# Altium schematic sheet Papilio_DUO_0.SchDoc: Papilio_DUO
size 720 x 381 mm; Date: 05/10/2018 09:53:51 p.m.; Organization: INVAP S.E.; Address1: Argentina; Address2: Rio Negro; Address3: Bariloche; Address4: Cte. Luis Piedra Buena 4950; SheetNumber: 1; DATABASE: C:/Dropbox/GadgetFactory/GadgetFactory_Engineering/Libraries/GadgetFactory-PARTSDB.txt; Rule: PcbType=ProtelPcb
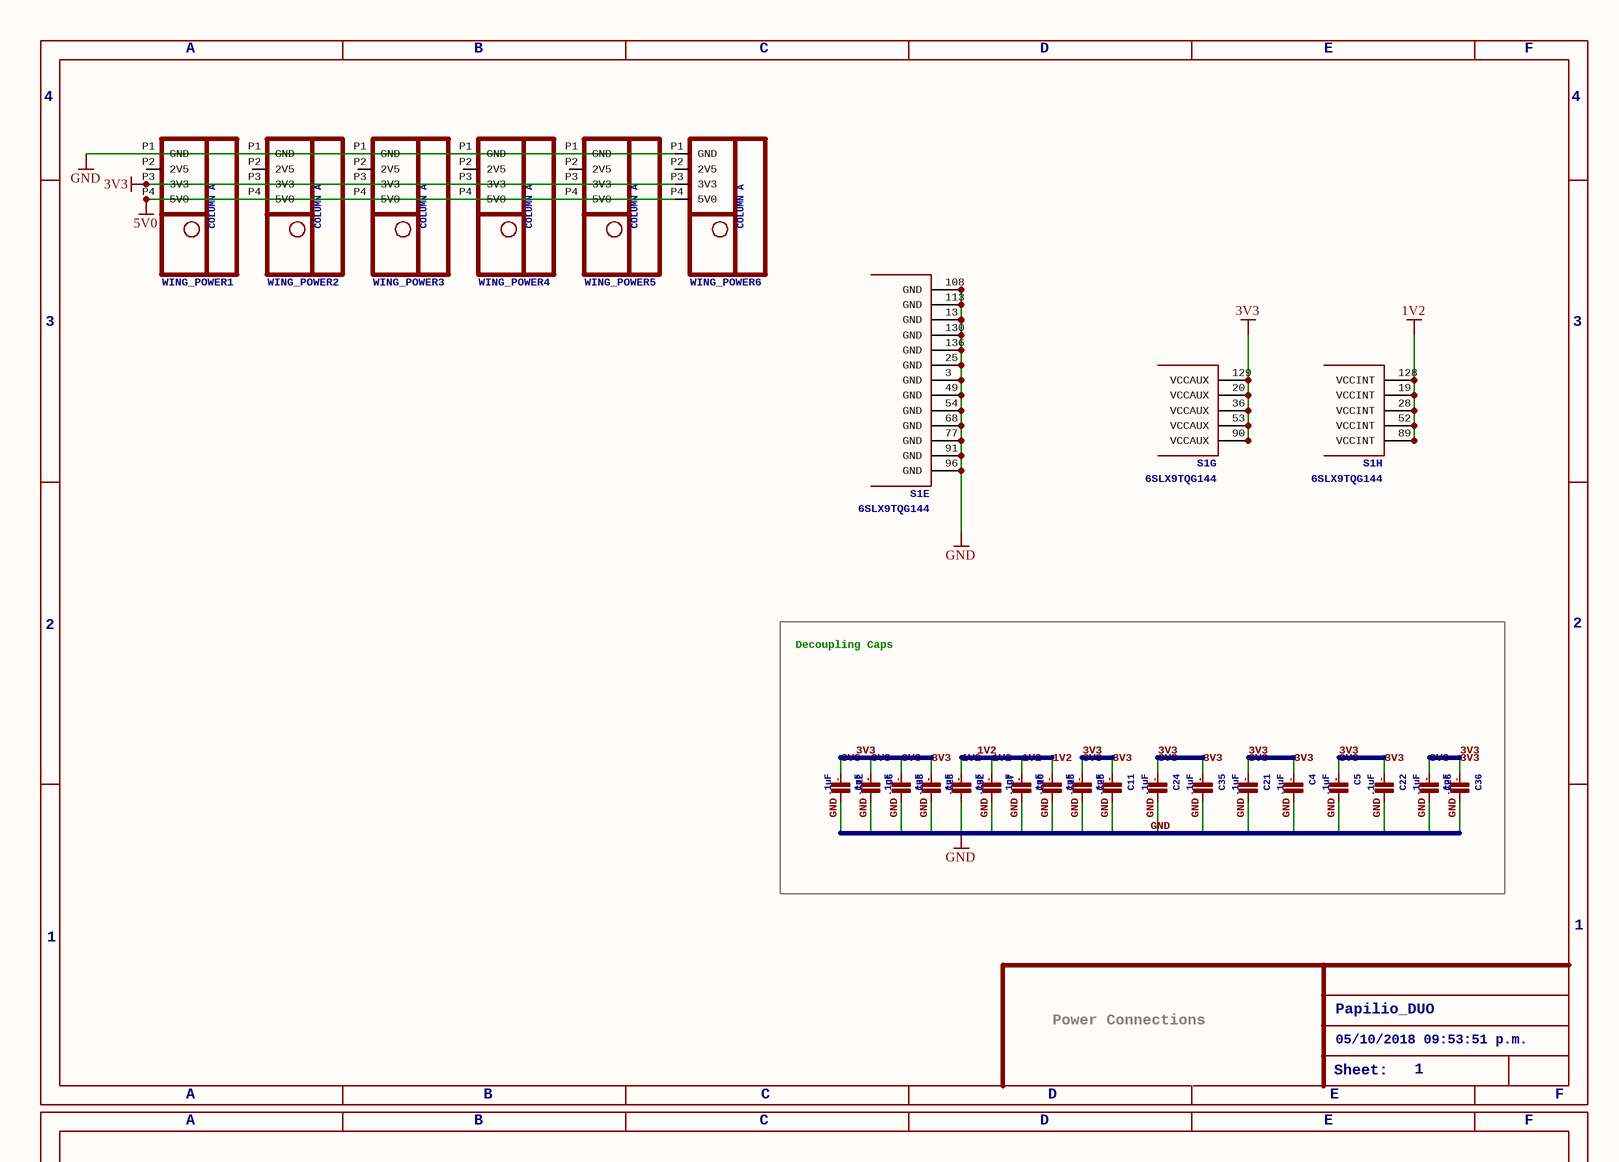
[diagram p0: Papilio_DUO_0.SchDoc, top left]
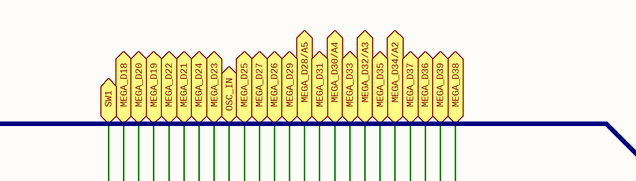
[diagram p1: Papilio_DUO_0.SchDoc, top middle]
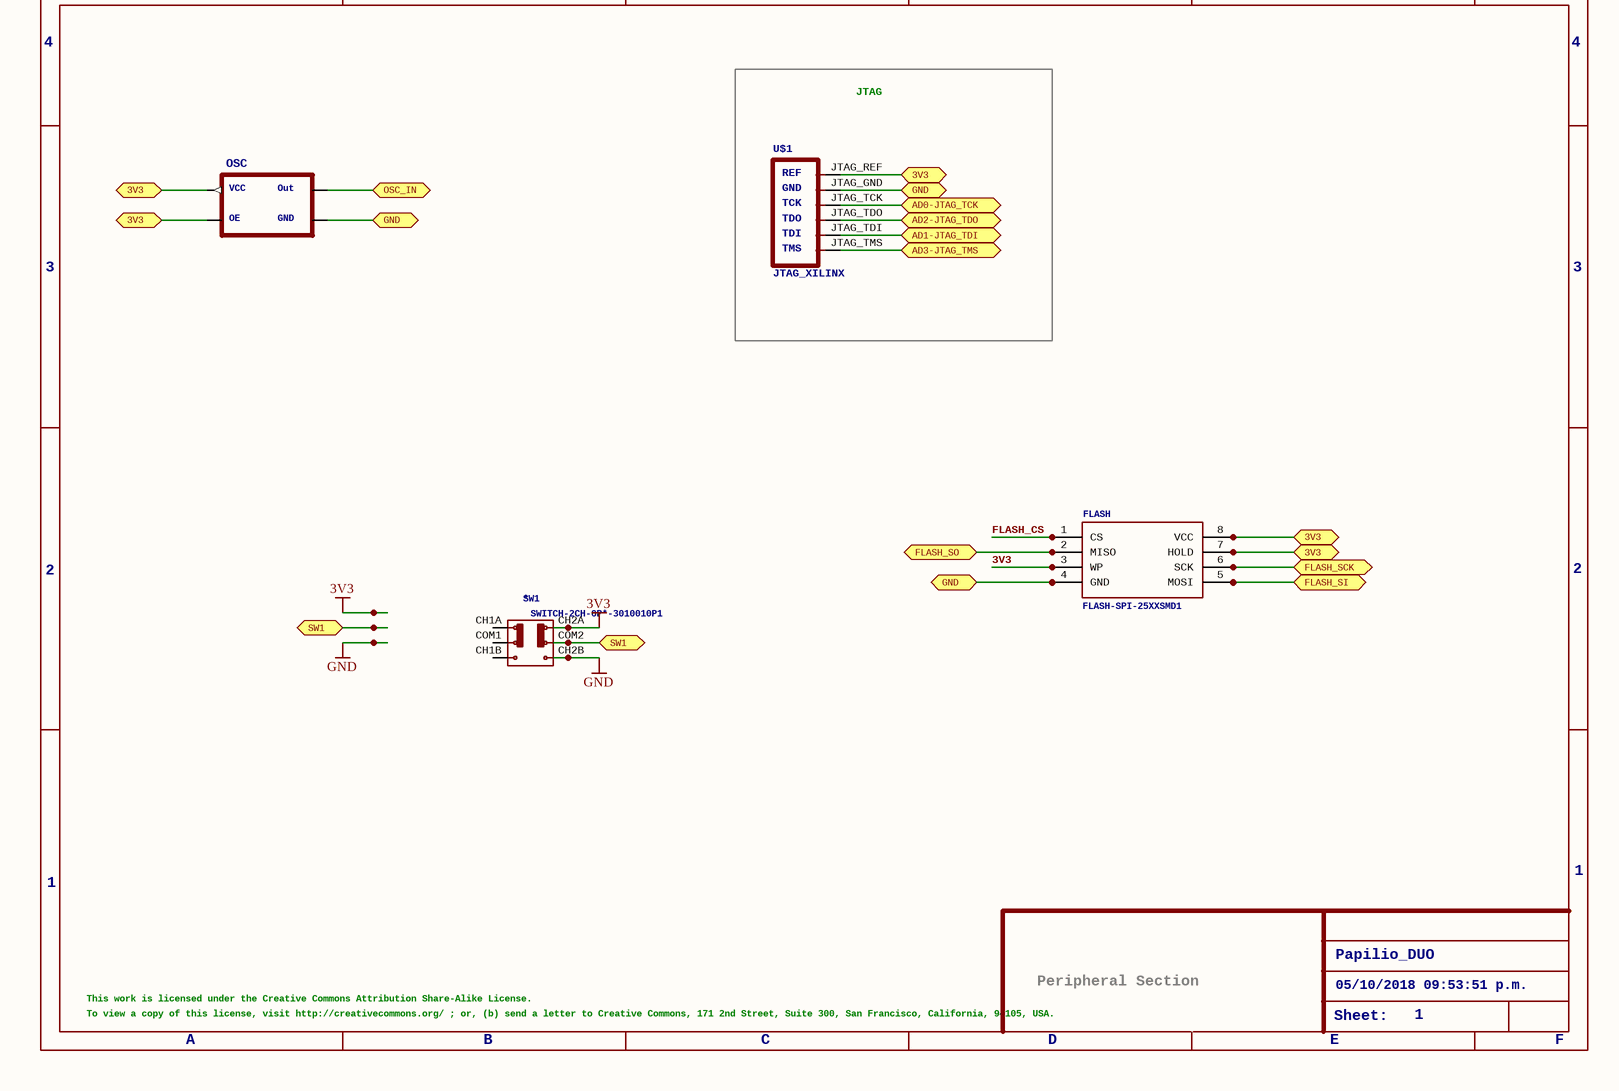
[diagram p2: Papilio_DUO_0.SchDoc, bottom left]
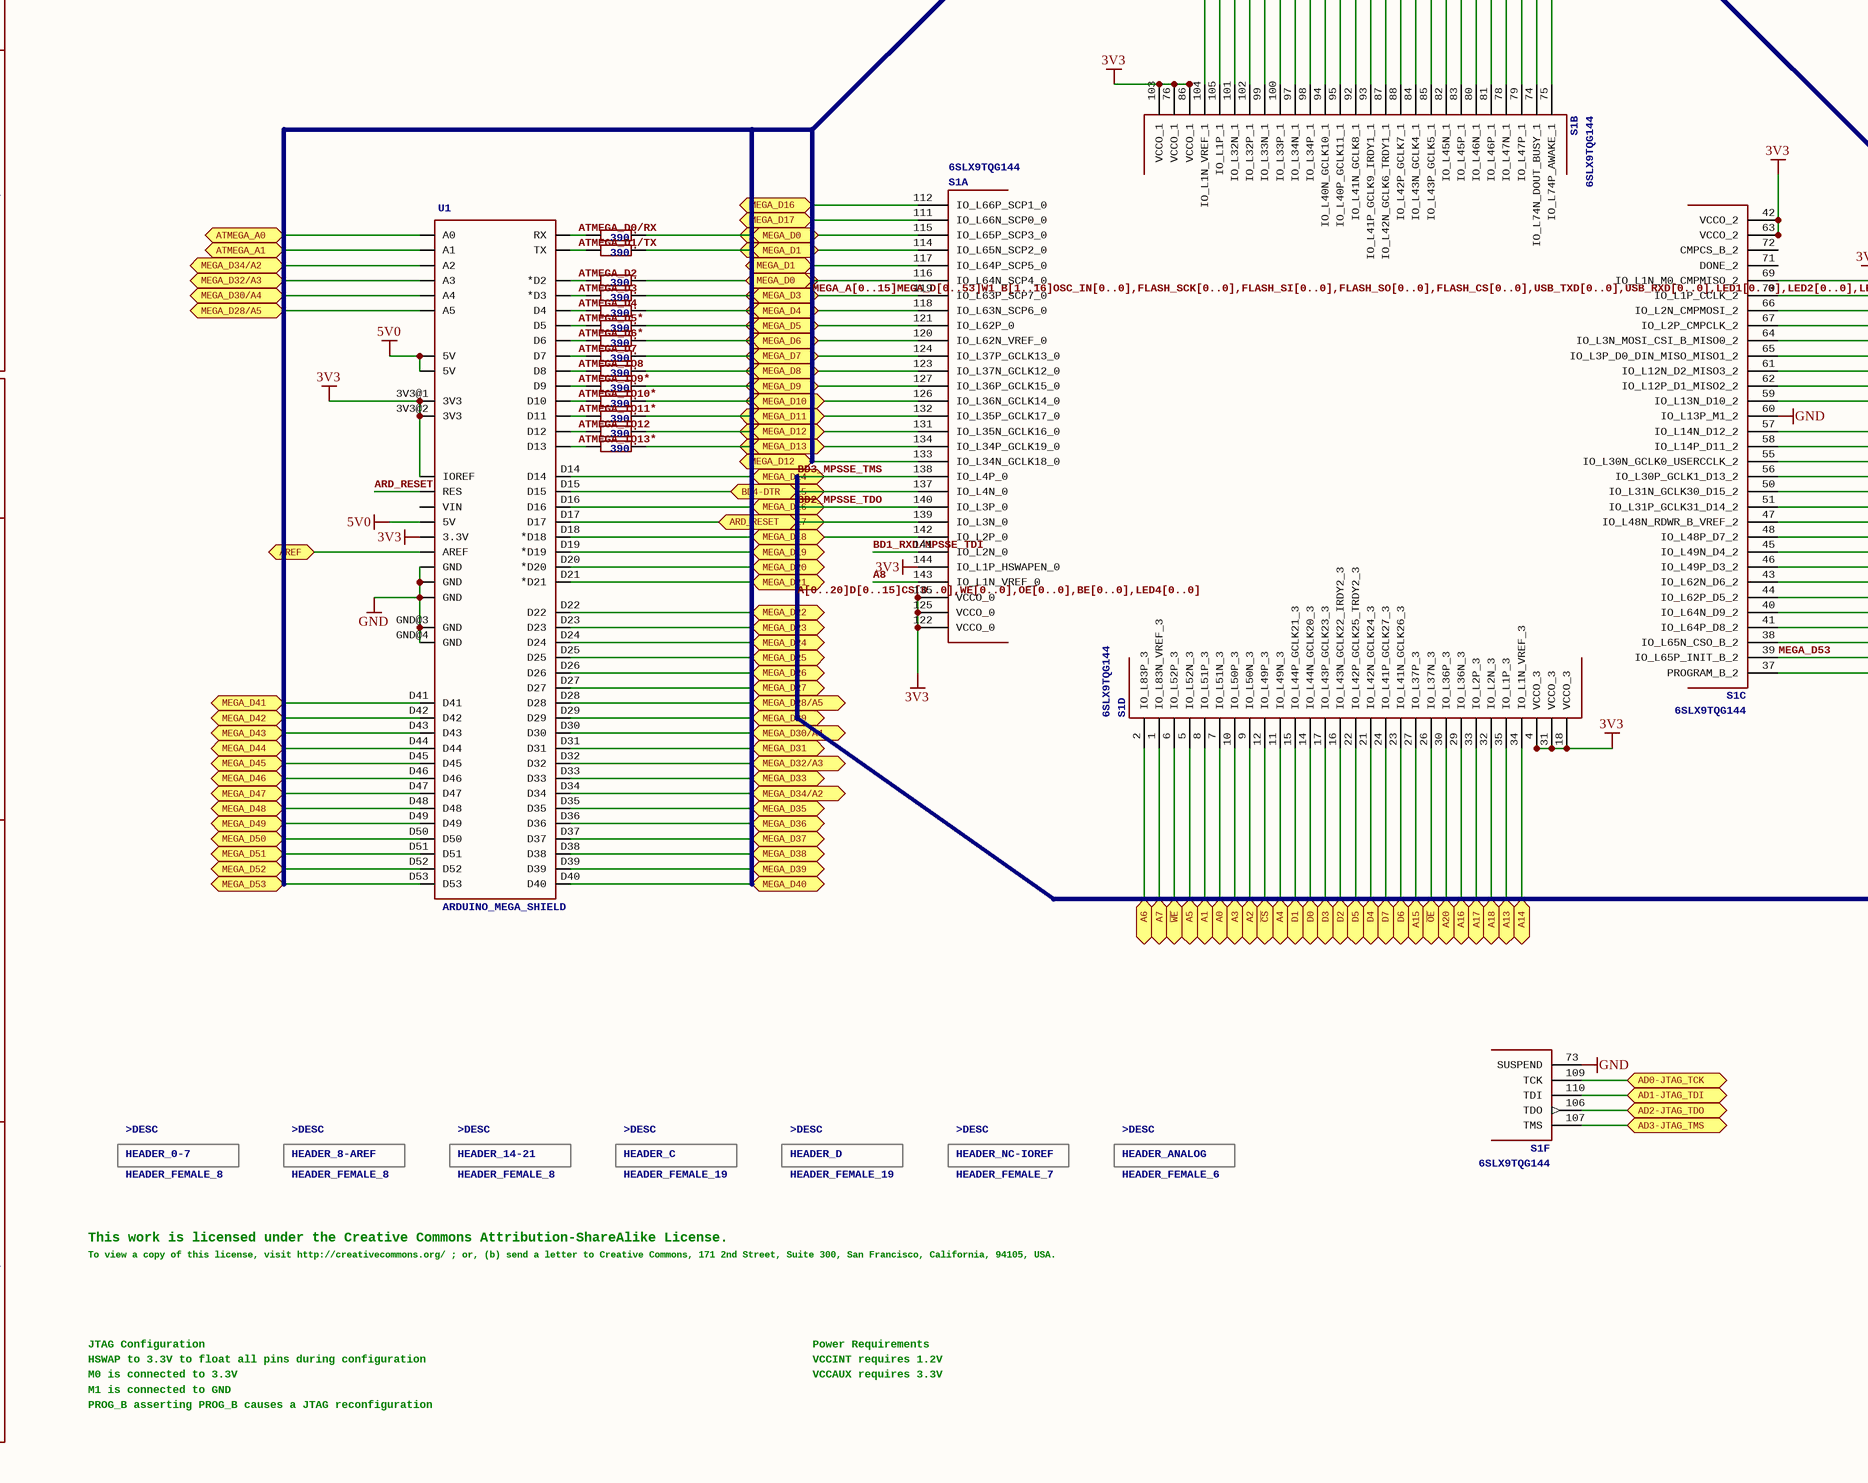
[diagram p3: Papilio_DUO_0.SchDoc, bottom middle]
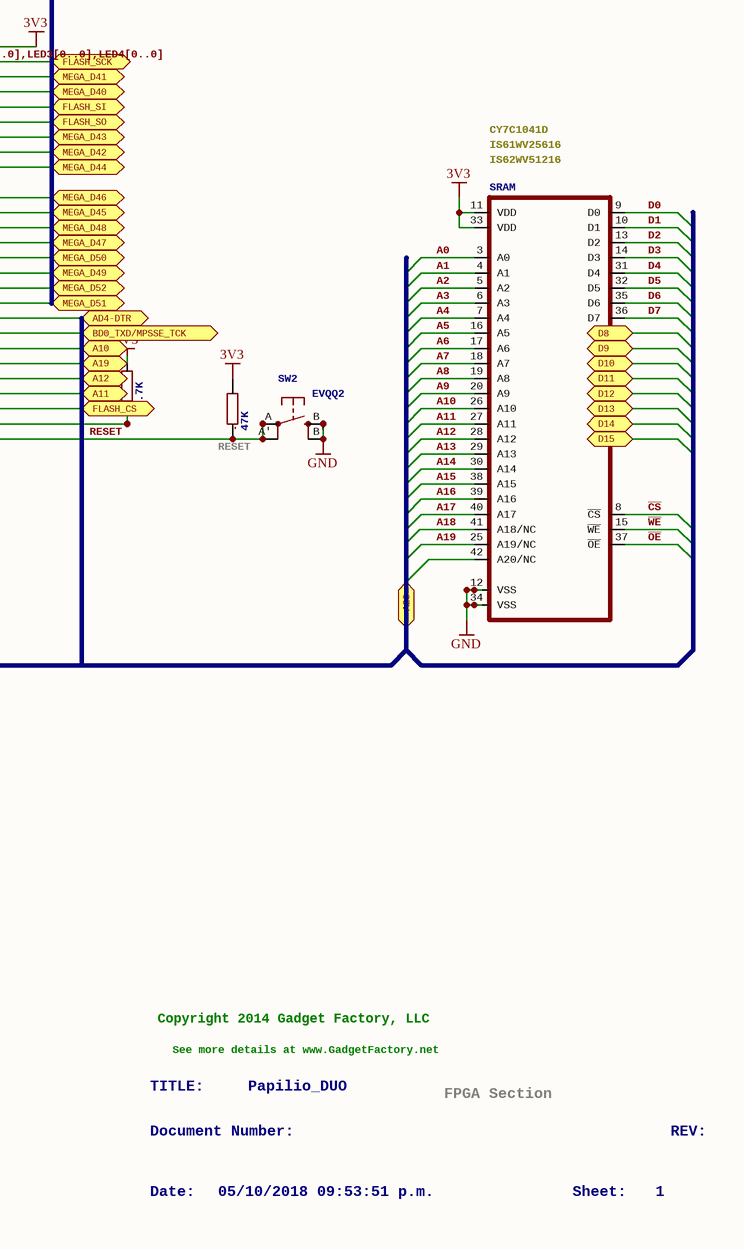
[diagram p4: Papilio_DUO_0.SchDoc, bottom right]

## Parts
C4  .1uF  [0603]
C5  .1uF  [0603]
C6  .1uF  [0603]
C7  .1uF  [0603]
C10  .1uF  [0603]
C11  .1uF  [0603]
C12  .1uF  [0603]
C13  .1uF  [0603]
C21  .1uF  [0603]
C22  .1uF  [0603]
C23  .1uF  [0603]
C24  .1uF  [0603]
C25  .1uF  [0603]
C26  .1uF  [0603]
C32  .1uF  [0603]
C33  .1uF  [0603]
C35  .1uF  [0603]
C36  .1uF  [0603]
FLASH  FLASH-SPI-25XXSMD1  [SO08-EIAJ]
FRAME2  DRAWING_NAME: Papilio_DUO  LAST_DATE_TIME: 05/10/2018 09:53:51 p.m.  SHEET: 1  Sheet: Sheet:  (hidden comment: FRAME-A4L-LOC)
FRAME4  DRAWING_NAME: Papilio_DUO  LAST_DATE_TIME: 05/10/2018 09:53:51 p.m.  SHEET: 1  Sheet: Sheet:  (hidden comment: FRAME-A4L-LOC)
HEADER_0-7  HEADER_FEMALE_8  DESC: >DESC
HEADER_8-AREF  HEADER_FEMALE_8  DESC: >DESC
HEADER_14-21  HEADER_FEMALE_8  DESC: >DESC
HEADER_ANALOG  HEADER_FEMALE_6  DESC: >DESC
HEADER_C  HEADER_FEMALE_19  DESC: >DESC
HEADER_D  HEADER_FEMALE_19  DESC: >DESC
HEADER_NC-IOREF  HEADER_FEMALE_7  DESC: >DESC
OSC  OSC1  [OSC1]  (value not drawn)
R8  390  [0603]
R9  390  [0603]
R10  390  [0603]
R11  390  [0603]
R12  390  [0603]
R13  390  [0603]
R14  390  [0603]
R15  390  [0603]
R16  390  [0603]
R17  390  [0603]
R18  390  [0603]
R19  390  [0603]
R20  390  [0603]
R21  390  [0603]
R31  47K  [0805]
R32  4.7K  [0603]
S1  6SLX9TQG144  [TQ144]  (parts A,B,C,D,E,F,G,H of 8)
SRAM  ISSI_SRAM_8BIT  [TSOP44-II]  (value not drawn)
SW1  SWITCH-2CH-6P*-3010010P1  [6P-2CH-2.54-9.1X3.5X3.2+2H]
SW2  EVQQ2  [EVQ-Q2]
U1  ARDUINO_MEGA_SHIELD  [ARDUINO_MEGA_SHIELD]
U$1  JTAG_XILINX  [JTAG]
WING_POWER1  COLUMNA: COLUMN A  [POWER_NO_TEXT]  (hidden comment: HEADER_FEMALE_4)
WING_POWER2  COLUMNA: COLUMN A  [POWER_NO_TEXT]  (hidden comment: HEADER_FEMALE_4)
WING_POWER3  COLUMNA: COLUMN A  [POWER_NO_TEXT]  (hidden comment: HEADER_FEMALE_4)
WING_POWER4  COLUMNA: COLUMN A  [POWER_NO_TEXT]  (hidden comment: HEADER_FEMALE_4)
WING_POWER5  COLUMNA: COLUMN A  [POWER_NO_TEXT]  (hidden comment: HEADER_FEMALE_4)
WING_POWER6  COLUMNA: COLUMN A  [POWER_NO_TEXT]  (hidden comment: HEADER_FEMALE_4)

## Blocks framed on the sheet
Decoupling Caps: C4-C7 C10-C13 C21-C26 C32 C33 C35 C36
JTAG: U$1

## Ports
3V3, A0, A1, A2, A3, A4, A5, A6, A7, A9, A10, A11, A12, A13, A14, A15, A16, A17, A18, A19, A20, AD0-JTAG_TCK, AD1-JTAG_TDI, AD2-JTAG_TDO, AD3-JTAG_TMS, AD4-DTR, ARD_RESET, AREF, ATMEGA_A0, ATMEGA_A1, BD0_TXD/MPSSE_TCK, BD4-DTR, D0, D1, D2, D3, D4, D5, D6, D7, D8, D9, D10, D11, D12, D13, D14, D15, FLASH_CS, FLASH_SCK, FLASH_SI, FLASH_SO, GND, MEGA_D0, MEGA_D1, MEGA_D2, MEGA_D3, MEGA_D4, MEGA_D5, MEGA_D6, MEGA_D7, MEGA_D8, MEGA_D9, MEGA_D10, MEGA_D11, MEGA_D12, MEGA_D13, MEGA_D14, MEGA_D15, MEGA_D16, MEGA_D17, MEGA_D18, MEGA_D19, MEGA_D20, MEGA_D21, MEGA_D22, MEGA_D23, MEGA_D24, MEGA_D25, MEGA_D26, MEGA_D27, MEGA_D28/A5, MEGA_D29, MEGA_D30/A4, MEGA_D31, MEGA_D32/A3, MEGA_D33, MEGA_D34/A2, MEGA_D35, MEGA_D36, MEGA_D37, MEGA_D38, MEGA_D39, MEGA_D40, MEGA_D41, MEGA_D42, MEGA_D43, MEGA_D44, MEGA_D45, MEGA_D46, MEGA_D47, MEGA_D48, MEGA_D49, MEGA_D50, MEGA_D51, MEGA_D52, MEGA_D53, OSC_IN, SW1, ~{CS}, ~{OE}, ~{WE}

## Nets
1V2: C7.1 C10.1 C13.1 C32.1 S1.19(VCCINT) S1.28(VCCINT) S1.52(VCCINT) S1.89(VCCINT) S1.128(VCCINT)
3V3: C4.1 C5.1 C6.1 C11.1 C12.1 C21.1 C22.1 C23.1 C24.1 C25.1 C26.1 C33.1 C35.1 C36.1 FLASH.3(WP) R31.2 R32.2 S1.4(VCCO_3) S1.18(VCCO_3) S1.20(VCCAUX) S1.31(VCCO_3) S1.36(VCCAUX) S1.42(VCCO_2) S1.44(IO_L62P_D5_2) S1.53(VCCAUX) S1.63(VCCO_2) S1.69(IO_L1N_M0_CMPMISO_2) S1.76(VCCO_1) S1.86(VCCO_1) S1.90(VCCAUX) S1.103(VCCO_1) S1.122(VCCO_0) S1.125(VCCO_0) S1.129(VCCAUX) S1.135(VCCO_0) S1.144(IO_L1P_HSWAPEN_0) SRAM.11(VDD) SRAM.33(VDD) SW1.CH2A U1.3.3V U1.3V3@1(3V3) U1.3V3@2(3V3) U1.IOREF WING_POWER1.P3(3V3) WING_POWER2.P3(3V3) WING_POWER3.P3(3V3) WING_POWER4.P3(3V3) WING_POWER5.P3(3V3) WING_POWER6.P3(3V3) ; port A19
5V0: U1.5V@0(5V) U1.5V@1(5V) U1.5V@2(5V) WING_POWER1.P4(5V0) WING_POWER2.P4(5V0) WING_POWER3.P4(5V0) WING_POWER4.P4(5V0) WING_POWER5.P4(5V0) WING_POWER6.P4(5V0)
GND: C4.2 C5.2 C6.2 C7.2 C10.2 C11.2 C12.2 C13.2 C21.2 C22.2 C23.2 C24.2 C25.2 C26.2 C32.2 C33.2 C35.2 C36.2 S1.3(GND) S1.13(GND) S1.25(GND) S1.49(GND) S1.54(GND) S1.60(IO_L13P_M1_2) S1.68(GND) S1.73(SUSPEND) S1.77(GND) S1.91(GND) S1.96(GND) S1.108(GND) S1.113(GND) S1.130(GND) S1.136(GND) SRAM.12(VSS) SRAM.34(VSS) SW1.CH2B SW2.B(S) SW2.B'(S1) U1.GND@0(GND) U1.GND@1(GND) U1.GND@2(GND) U1.GND@3(GND) U1.GND@4(GND) WING_POWER1.P1(GND) WING_POWER2.P1(GND) WING_POWER3.P1(GND) WING_POWER4.P1(GND) WING_POWER5.P1(GND) WING_POWER6.P1(GND)
3V3: FLASH.7(HOLD) FLASH.8(VCC) OSC.1@1(OE) OSC.4@4(VCC) U$1.JTAG_REF ; port 3V3  [a separate net that carries the same name]
A0: SRAM.3(A0)
A0: S1.7(IO_L51N_3) ; port A0  [a separate net that carries the same name]
A1: SRAM.4(A1)
A1: S1.8(IO_L51P_3) ; port A1  [a separate net that carries the same name]
A2: SRAM.5(A2)
A2: S1.9(IO_L50N_3) ; port A2  [a separate net that carries the same name]
A3: SRAM.6(A3)
A3: S1.10(IO_L50P_3) ; port A3  [a separate net that carries the same name]
A4: SRAM.7(A4)
A4: S1.11(IO_L49N_3) ; port A4  [a separate net that carries the same name]
A5: SRAM.16(A5)
A5: S1.5(IO_L52N_3) ; port A5  [a separate net that carries the same name]
A6: SRAM.17(A6)
A6: S1.2(IO_L83P_3) ; port A6  [a separate net that carries the same name]
A7: SRAM.18(A7)
A7: S1.1(IO_L83N_VREF_3) ; port A7  [a separate net that carries the same name]
A8: S1.143(IO_L1N_VREF_0) SRAM.19(A8)
A9: S1.105(IO_L1P_1) S1.142(IO_L2P_0) U1.D18(*D18) ; port A9, port MEGA_D18
A9: SRAM.20(A9)  [a separate net that carries the same name]
A10: SRAM.26(A10)
A10: S1.43(IO_L62N_D6_2) ; port A10  [a separate net that carries the same name]
A11: SRAM.27(A11)
A11: S1.41(IO_L64P_D8_2) ; port A11  [a separate net that carries the same name]
A12: SRAM.28(A12)
A12: S1.40(IO_L64N_D9_2) ; port A12  [a separate net that carries the same name]
A13: SRAM.29(A13)
A13: S1.35(IO_L1P_3) ; port A13  [a separate net that carries the same name]
A14: SRAM.30(A14)
A14: S1.34(IO_L1N_VREF_3) ; port A14  [a separate net that carries the same name]
A15: SRAM.38(A15)
A15: S1.27(IO_L37P_3) ; port A15  [a separate net that carries the same name]
A16: SRAM.39(A16)
A16: S1.29(IO_L36N_3) ; port A16  [a separate net that carries the same name]
A17: SRAM.40(A17)
A17: S1.33(IO_L2P_3) ; port A17  [a separate net that carries the same name]
A18: SRAM.41(A18/NC)
A18: S1.32(IO_L2N_3) ; port A18  [a separate net that carries the same name]
A19: SRAM.25(A19/NC)
A20: S1.30(IO_L36P_3) SRAM.42(A20/NC) ; port A20
AD0-JTAG_TCK: S1.109(TCK) U$1.JTAG_TCK ; port AD0-JTAG_TCK
AD1-JTAG_TDI: S1.110(TDI) U$1.JTAG_TDI ; port AD1-JTAG_TDI
AD2-JTAG_TDO: S1.106(TDO) U$1.JTAG_TDO ; port AD2-JTAG_TDO
AD3-JTAG_TMS: S1.107(TMS) U$1.JTAG_TMS ; port AD3-JTAG_TMS
AD4-DTR: S1.45(IO_L49N_D4_2) ; port AD4-DTR
ARD_RESET: S1.111(IO_L66N_SCP0_0) S1.139(IO_L3N_0) U1.D17 ; port MEGA_D17, port ARD_RESET
ARD_RESET: U1.RES  [a separate net that carries the same name]
AREF: U1.AREF ; port AREF
ATMEGA_A0: U1.A0 ; port ATMEGA_A0
ATMEGA_A1: U1.A1 ; port ATMEGA_A1
ATMEGA_D0/RX: R21.2 U1.RX
ATMEGA_D1/TX: R20.2 U1.TX
ATMEGA_D2: R19.2 U1.D2(*D2)
ATMEGA_D3: R18.2 U1.D3(*D3)
ATMEGA_D4: R17.2 U1.D4
ATMEGA_D5*: R16.2 U1.D5
ATMEGA_D6*: R15.2 U1.D6
ATMEGA_D7: R14.2 U1.D7
ATMEGA_IO8: R13.2 U1.D8
ATMEGA_IO9*: R12.2 U1.D9
ATMEGA_IO10*: R11.2 U1.D10
ATMEGA_IO11*: R10.2 U1.D11
ATMEGA_IO12: R9.2 U1.D12
ATMEGA_IO13*: R8.2 U1.D13
BD0_TXD/MPSSE_TCK: S1.46(IO_L49P_D3_2) ; port BD0_TXD/MPSSE_TCK
BD1_RXD/MPSSE_TDI: S1.141(IO_L2N_0)
BD2_MPSSE_TDO: S1.112(IO_L66P_SCP1_0) S1.140(IO_L3P_0) U1.D16 ; port MEGA_D16
BD3_MPSSE_TMS: R9.1 R11.1 R13.1 R15.1 R17.1 R19.1 R21.1 S1.115(IO_L65P_SCP3_0) S1.116(IO_L64N_SCP4_0) S1.118(IO_L63N_SCP6_0) S1.120(IO_L62N_VREF_0) S1.123(IO_L37N_GCLK12_0) S1.126(IO_L36N_GCLK14_0) S1.131(IO_L35N_GCLK16_0) S1.133(IO_L34N_GCLK18_0) S1.138(IO_L4P_0) U1.D14 ; port MEGA_D2, port MEGA_D4, port MEGA_D6, port MEGA_D8, port MEGA_D10, port MEGA_D12, port MEGA_D14, port MEGA_D0
BD4-DTR: R20.1 S1.114(IO_L65N_SCP2_0) S1.117(IO_L64P_SCP5_0) S1.137(IO_L4N_0) U1.D15 ; port MEGA_D15, port MEGA_D1, port BD4-DTR
~{CS}: SRAM.8(~{CS})
~{CS}: S1.12(IO_L49P_3) ; port ~{CS}  [a separate net that carries the same name]
D0: SRAM.9(D0)
D0: S1.14(IO_L44N_GCLK20_3) ; port D0  [a separate net that carries the same name]
D1: SRAM.10(D1)
D1: S1.15(IO_L44P_GCLK21_3) ; port D1  [a separate net that carries the same name]
D2: SRAM.13(D2)
D2: S1.16(IO_L43N_GCLK22_IRDY2_3) ; port D2  [a separate net that carries the same name]
D3: SRAM.14(D3)
D3: S1.17(IO_L43P_GCLK23_3) ; port D3  [a separate net that carries the same name]
D4: SRAM.31(D4)
D4: S1.21(IO_L42N_GCLK24_3) ; port D4  [a separate net that carries the same name]
D5: SRAM.32(D5)
D5: S1.22(IO_L42P_GCLK25_TRDY2_3) ; port D5  [a separate net that carries the same name]
D6: SRAM.35(D6)
D6: S1.23(IO_L41N_GCLK26_3) ; port D6  [a separate net that carries the same name]
D7: SRAM.36(D7)
D7: S1.24(IO_L41P_GCLK27_3) ; port D7  [a separate net that carries the same name]
FLASH_CS: FLASH.1(CS)
FLASH_CS: S1.38(IO_L65N_CSO_B_2) ; port FLASH_CS  [a separate net that carries the same name]
FLASH_SCK: FLASH.6(SCK) S1.70(IO_L1P_CCLK_2) ; port FLASH_SCK
FLASH_SI: FLASH.5(MOSI) S1.64(IO_L3N_MOSI_CSI_B_MISO0_2) ; port FLASH_SI
FLASH_SO: FLASH.2(MISO) S1.65(IO_L3P_D0_DIN_MISO_MISO1_2) ; port FLASH_SO
GND: FLASH.4(GND) OSC.2@2(GND) U$1.JTAG_GND ; port GND  [a separate net that carries the same name]
MEGA_A[0..15]MEGA_D[0..53]W1_B[1..16]OSC_IN[0..0],FLASH_SCK[0..0],FLASH_SI[0..0],FLASH_SO[0..0],FLASH_CS[0..0],USB_TXD[0..0],USB_RXD[0..0],LED1[0..0],LED2[0..0],LED3[0..0],LED4[0..0]: R18.1 S1.119(IO_L63P_SCP7_0) ; port MEGA_D3
MEGA_D5: R16.1 S1.121(IO_L62P_0) ; port MEGA_D5
MEGA_D7: R14.1 S1.124(IO_L37P_GCLK13_0) ; port MEGA_D7
MEGA_D9: R12.1 S1.127(IO_L36P_GCLK15_0) ; port MEGA_D9
MEGA_D11: R10.1 S1.132(IO_L35P_GCLK17_0) ; port MEGA_D11
MEGA_D13: R8.1 S1.134(IO_L34P_GCLK19_0) ; port MEGA_D13
MEGA_D19: S1.102(IO_L32P_1) U1.D19(*D19) ; port MEGA_D19
MEGA_D20: S1.101(IO_L32N_1) U1.D20(*D20) ; port MEGA_D20
MEGA_D21: S1.100(IO_L33P_1) U1.D21(*D21) ; port MEGA_D21
MEGA_D22: S1.99(IO_L33N_1) U1.D22 ; port MEGA_D22
MEGA_D23: S1.98(IO_L34P_1) U1.D23 ; port MEGA_D23
MEGA_D24: S1.97(IO_L34N_1) U1.D24 ; port MEGA_D24
MEGA_D25: S1.95(IO_L40P_GCLK11_1) U1.D25 ; port MEGA_D25
MEGA_D26: S1.93(IO_L41P_GCLK9_IRDY1_1) U1.D26 ; port MEGA_D26
MEGA_D27: S1.92(IO_L41N_GCLK8_1) U1.D27 ; port MEGA_D27
MEGA_D28/A5: S1.88(IO_L42P_GCLK7_1) U1.A5 U1.D28 ; port MEGA_D28/A5
MEGA_D29: S1.87(IO_L42N_GCLK6_TRDY1_1) U1.D29 ; port MEGA_D29
MEGA_D30/A4: S1.85(IO_L43P_GCLK5_1) U1.A4 U1.D30 ; port MEGA_D30/A4
MEGA_D31: S1.84(IO_L43N_GCLK4_1) U1.D31 ; port MEGA_D31
MEGA_D32/A3: S1.83(IO_L45P_1) U1.A3 U1.D32 ; port MEGA_D32/A3
MEGA_D33: S1.82(IO_L45N_1) U1.D33 ; port MEGA_D33
MEGA_D34/A2: S1.81(IO_L46P_1) U1.A2 U1.D34 ; port MEGA_D34/A2
MEGA_D35: S1.80(IO_L46N_1) U1.D35 ; port MEGA_D35
MEGA_D36: S1.79(IO_L47P_1) U1.D36 ; port MEGA_D36
MEGA_D37: S1.78(IO_L47N_1) U1.D37 ; port MEGA_D37
MEGA_D38: S1.75(IO_L74P_AWAKE_1) U1.D38 ; port MEGA_D38
MEGA_D39: S1.74(IO_L74N_DOUT_BUSY_1) U1.D39 ; port MEGA_D39
MEGA_D40: S1.67(IO_L2P_CMPCLK_2) U1.D40 ; port MEGA_D40
MEGA_D41: S1.66(IO_L2N_CMPMOSI_2) U1.D41 ; port MEGA_D41
MEGA_D42: S1.62(IO_L12P_D1_MISO2_2) U1.D42 ; port MEGA_D42
MEGA_D43: S1.61(IO_L12N_D2_MISO3_2) U1.D43 ; port MEGA_D43
MEGA_D44: S1.59(IO_L13N_D10_2) U1.D44 ; port MEGA_D44
MEGA_D45: S1.58(IO_L14P_D11_2) U1.D45 ; port MEGA_D45
MEGA_D46: S1.57(IO_L14N_D12_2) U1.D46 ; port MEGA_D46
MEGA_D47: S1.56(IO_L30P_GCLK1_D13_2) U1.D47 ; port MEGA_D47
MEGA_D48: S1.55(IO_L30N_GCLK0_USERCCLK_2) U1.D48 ; port MEGA_D48
MEGA_D49: S1.51(IO_L31P_GCLK31_D14_2) U1.D49 ; port MEGA_D49
MEGA_D50: S1.50(IO_L31N_GCLK30_D15_2) U1.D50 ; port MEGA_D50
MEGA_D51: S1.48(IO_L48P_D7_2) U1.D51 ; port MEGA_D51
MEGA_D52: S1.47(IO_L48N_RDWR_B_VREF_2) U1.D52 ; port MEGA_D52
MEGA_D53: U1.D53 ; port MEGA_D53
MEGA_D53: R32.1 S1.39(IO_L65P_INIT_B_2)  [a separate net that carries the same name]
~{OE}: SRAM.37(~{OE})
~{OE}: S1.26(IO_L37N_3) ; port ~{OE}  [a separate net that carries the same name]
OSC_IN: OSC.3@3(OUT) S1.94(IO_L40N_GCLK10_1) ; port OSC_IN
RESET: R31.1 S1.37(PROGRAM_B_2) SW2.A(P) SW2.A'(P1)
SW1: S1.104(IO_L1N_VREF_1) SW1.COM2 ; port SW1
~{WE}: SRAM.15(~{WE})
~{WE}: S1.6(IO_L52P_3) ; port ~{WE}  [a separate net that carries the same name]

Not connected (* = marked no-connect by the designer): S1 71(DONE_2) 72(CMPCS_B_2); SW1 CH1A CH1B COM1; U1 VIN; WING_POWER1 P2(2V5); WING_POWER2 P2(2V5); WING_POWER3 P2(2V5); WING_POWER4 P2(2V5); WING_POWER5 P2(2V5); WING_POWER6 P2(2V5)

## Buses and harness runs
bus 1V2
bus 3V3
bus A[0..20]D[0..15]CS[0..0],WE[0..0],OE[0..0],BE[0..0],LED4[0..0]
bus GND

## Notes on the sheet
- Power Connections
- (near SRAM) IS62WV51216
- IS61WV25616
- CY7C1041D
- (near R31) RESET
- This work is licensed under the Creative Commons Attribution-ShareAlike License.
- To view a copy of this license, visit http://creativecommons.org/ ; or, (b) send a letter to Creative Commons, 171 2nd Street, Suite 300, San Francisco, California, 94105, USA.
- Copyright 2014 Gadget Factory, LLC
- See more details at www.GadgetFactory.net
- Peripheral Section
- JTAG Configuration
- HSWAP to 3.3V to float all pins during configuration
- M0 is connected to 3.3V
- Power Requirements
- VCCINT requires 1.2V
- VCCAUX requires 3.3V
- TITLE:
- Document Number:
- Papilio_DUO
- FPGA Section
- REV:
- This work is licensed under the Creative Commons Attribution Share-Alike License.
- (near FRAME2) To view a copy of this license, visit http://creativecommons.org/ ; or, (b) send a letter to Creative Commons, 171 2nd Street, Suite 300, San Francisco, California, 94105, USA.
- M1 is connected to GND
- PROG_B asserting PROG_B causes a JTAG reconfiguration
- Date:
- 05/10/2018 09:53:51 p.m.
- Sheet:
- 1
- 2
- 3
- 4
- 5
- 6
- 7
- 8
- 9
- A
- B
- C
- D
- E
- Título:
- F
- Nº
- Hoja:
- de:
- Escala:
- *

## Library data of the parts
C4-C7 C10-C13 C21-C26 C32 C33 C35 C36 = C0603: CAPACITOR, European symbol; PARTNO: *
FLASH = FLASH-SPI-25XXSMD1: SPI Flash; PARTNO: *
FRAME2 FRAME4 = FRAME-A4L-LOC: FRAME   DIN A4, landscape with location and doc. field; A: A; B: B; C: C; D: D; E: E; F: F; 1: 1; 2: 2; 3: 3; 4: 4
HEADER_0-7 HEADER_8-AREF HEADER_14-21 = BOM-PART: BOM ENTRY   Special BOM entry-only specifier field.; PARTNO: PPTC081LFBN-RC; BOM: INCLUDE; QTY: 1
HEADER_ANALOG = BOM-PART: BOM ENTRY   Special BOM entry-only specifier field.; PARTNO: PPTC061LFBN-RC; BOM: INCLUDE; QTY: 1
HEADER_C HEADER_D = BOM-PART: BOM ENTRY   Special BOM entry-only specifier field.; PARTNO: PPTC191LFBN-RC; BOM: INCLUDE; QTY: 1
HEADER_NC-IOREF = BOM-PART: BOM ENTRY   Special BOM entry-only specifier field.; PARTNO: PPTC071LFBN-RC; BOM: INCLUDE; QTY: 1
R8-R21 R32 = R0603: RESISTOR, European symbol; PARTNO: *
R31 = R0805: RESISTOR, European symbol; PARTNO: *
S1 = 6SLX9TQG144: Xilinx FPGA: 6SLX9TQG144; PARTNO: *
SW1 = SWITCH-2CH-6P*-3010010P1: MS-22D18 G2 ROHS; NAME: *; PARTNO: *
SW2 = EVQQ2: SMT 6mm switch, EVQQ2 series    http://www.ladyada.net/library/eagle; PARTNO: *
WING_POWER1-WING_POWER6 = POWER_ONLYNOTEXT: PARTNO: *
OSC = OSC1: PARTNO: *; OE: OE; GND: GND; VCC: VCC; Out: Out
SRAM = ISSI_SRAM_8BIT: PARTNO: *
U1 = ARDUINO_MEGA_SHIELD: BOM: *
U$1 = JTAG_XILINX: BOM: *; REF: REF; GND: GND; TCK: TCK; TDO: TDO; TDI: TDI; TMS: TMS